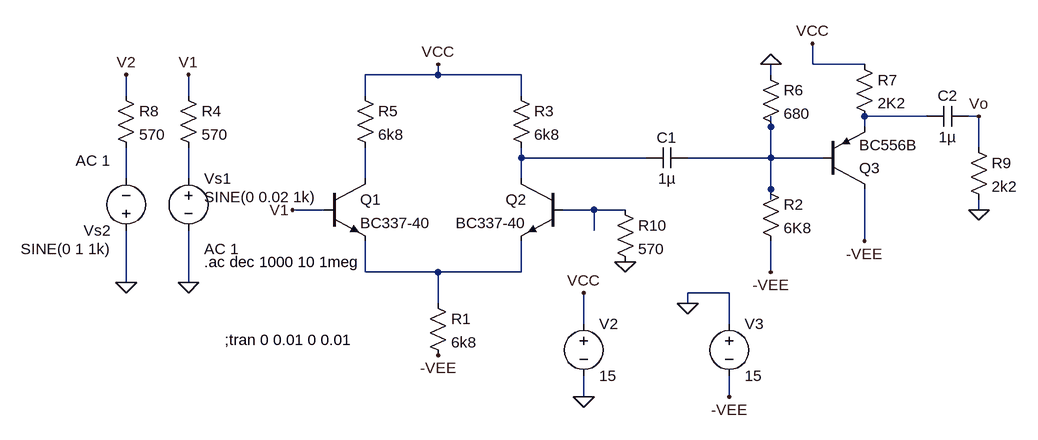
[diagram p0: schematic TP2-Opcion2.asc]
TP2-Opcion2.asc, the LTspice schematic file:
Version 4
SHEET 1 1272 680
WIRE 864 -48 864 -80
WIRE 944 -48 864 -48
WIRE 288 -32 288 -48
WIRE 288 -32 176 -32
WIRE 416 -32 288 -32
WIRE 800 -32 800 -48
WIRE -192 0 -192 -32
WIRE -96 0 -96 -32
WIRE 176 0 176 -32
WIRE 416 0 416 -32
WIRE 1040 32 944 32
WIRE 1120 32 1104 32
WIRE 800 48 800 32
WIRE 944 48 944 32
WIRE 1120 80 1120 32
WIRE 416 96 416 80
WIRE 608 96 416 96
WIRE 800 96 800 48
WIRE 800 96 672 96
WIRE 880 96 800 96
WIRE -192 128 -192 80
WIRE -96 128 -96 80
WIRE 176 128 176 80
WIRE 416 128 416 96
WIRE 800 144 800 96
WIRE 800 160 800 144
WIRE 112 176 64 176
WIRE 528 176 480 176
WIRE 576 176 528 176
WIRE 1120 176 1120 160
WIRE 528 208 528 176
WIRE 944 224 944 144
WIRE 176 272 176 224
WIRE 288 272 176 272
WIRE 416 272 416 224
WIRE 416 272 288 272
WIRE 800 272 800 224
WIRE -192 288 -192 208
WIRE -96 288 -96 208
WIRE 736 304 672 304
WIRE 288 320 288 272
WIRE 672 320 672 304
WIRE 512 352 512 304
WIRE 736 352 736 304
WIRE 512 464 512 432
WIRE 736 464 736 432
FLAG 800 -48 0
FLAG 864 -80 VCC
FLAG 288 -48 VCC
FLAG 64 176 V1
FLAG -96 -32 V1
FLAG 288 400 -VEE
FLAG 1120 32 Vo
FLAG -96 288 0
FLAG 512 464 0
FLAG 672 320 0
FLAG 512 304 VCC
FLAG 736 464 -VEE
FLAG 1120 176 0
FLAG -192 -32 V2
FLAG -192 288 0
FLAG 800 272 -VEE
FLAG 944 224 -VEE
FLAG 576 256 0
SYMBOL npn 112 128 R0
SYMATTR InstName Q1
SYMATTR Value BC337-40
SYMBOL npn 480 128 M0
SYMATTR InstName Q2
SYMATTR Value BC337-40
SYMBOL res 272 304 R0
SYMATTR InstName R1
SYMATTR Value 6k8
SYMBOL res 400 -16 R0
SYMATTR InstName R3
SYMATTR Value 6k8
SYMBOL cap 672 80 R90
WINDOW 0 0 32 VBottom 2
WINDOW 3 32 32 VTop 2
SYMATTR InstName C1
SYMATTR Value 1µ
SYMBOL res 784 -48 R0
SYMATTR InstName R6
SYMATTR Value 680
SYMBOL pnp 880 144 M180
SYMATTR InstName Q3
SYMATTR Value BC556B
SYMBOL res 928 -64 R0
SYMATTR InstName R7
SYMATTR Value 2K2
SYMBOL res -112 -16 R0
SYMATTR InstName R4
SYMATTR Value 570
SYMBOL res 160 -16 R0
SYMATTR InstName R5
SYMATTR Value 6k8
SYMBOL voltage -96 112 R0
WINDOW 123 24 124 Left 2
WINDOW 39 0 0 Left 0
WINDOW 3 24 44 Left 2
SYMATTR Value2 AC 1
SYMATTR Value SINE(0 0.02 1k)
SYMATTR InstName Vs1
SYMBOL voltage 512 336 R0
WINDOW 123 0 0 Left 0
WINDOW 39 0 0 Left 0
SYMATTR InstName V2
SYMATTR Value 15
SYMBOL voltage 736 336 R0
WINDOW 123 0 0 Left 0
WINDOW 39 0 0 Left 0
SYMATTR InstName V3
SYMATTR Value 15
SYMBOL cap 1104 16 R90
WINDOW 0 0 32 VBottom 2
WINDOW 3 32 32 VTop 2
SYMATTR InstName C2
SYMATTR Value 1µ
SYMBOL res 1104 64 R0
SYMATTR InstName R9
SYMATTR Value 2k2
SYMBOL res 784 128 R0
SYMATTR InstName R2
SYMATTR Value 6K8
SYMBOL res -208 -16 R0
SYMATTR InstName R8
SYMATTR Value 570
SYMBOL voltage -192 224 R180
WINDOW 123 24 124 Left 2
WINDOW 39 0 0 Left 0
WINDOW 3 24 -12 Left 2
SYMATTR Value2 AC 1
SYMATTR Value SINE(0 1 1k)
SYMATTR InstName Vs2
SYMBOL res 560 160 R0
SYMATTR InstName R10
SYMATTR Value 570
TEXT -72 256 Left 2 !.ac dec 1000 10 1meg
TEXT -40 376 Left 2 !;tran 0 0.01 0 0.01

The netlist it stands for:
* TP2-Opcion2.asc
Q1 N006 V1 N008 0 BC337-40
Q2 N003 N007 N008 0 BC337-40
R1 N008 -VEE 6k8
R3 VCC N003 6k8
C1 N002 N003 1µ
R6 0 N002 680
Q3 -VEE N002 N001 0 BC556B
R7 VCC N001 2K2
R4 V1 N005 570
R5 VCC N006 6k8
Vs1 N005 0 SINE(0 0.02 1k) AC 1
V2 VCC 0 15
V3 0 -VEE 15
C2 Vo N001 1µ
R9 Vo 0 2k2
R2 N002 -VEE 6K8
R8 V2 N004 570
Vs2 0 N004 SINE(0 1 1k) AC 1
R10 N007 0 570
.model NPN NPN
.model PNP PNP
.lib standard.bjt
.ac dec 1000 10 1meg
;tran 0 0.01 0 0.01
.backanno
.end